# EAGLE board PCB_ROHM_BaAnh (EAGLE 9.6.2), part 1 of 2
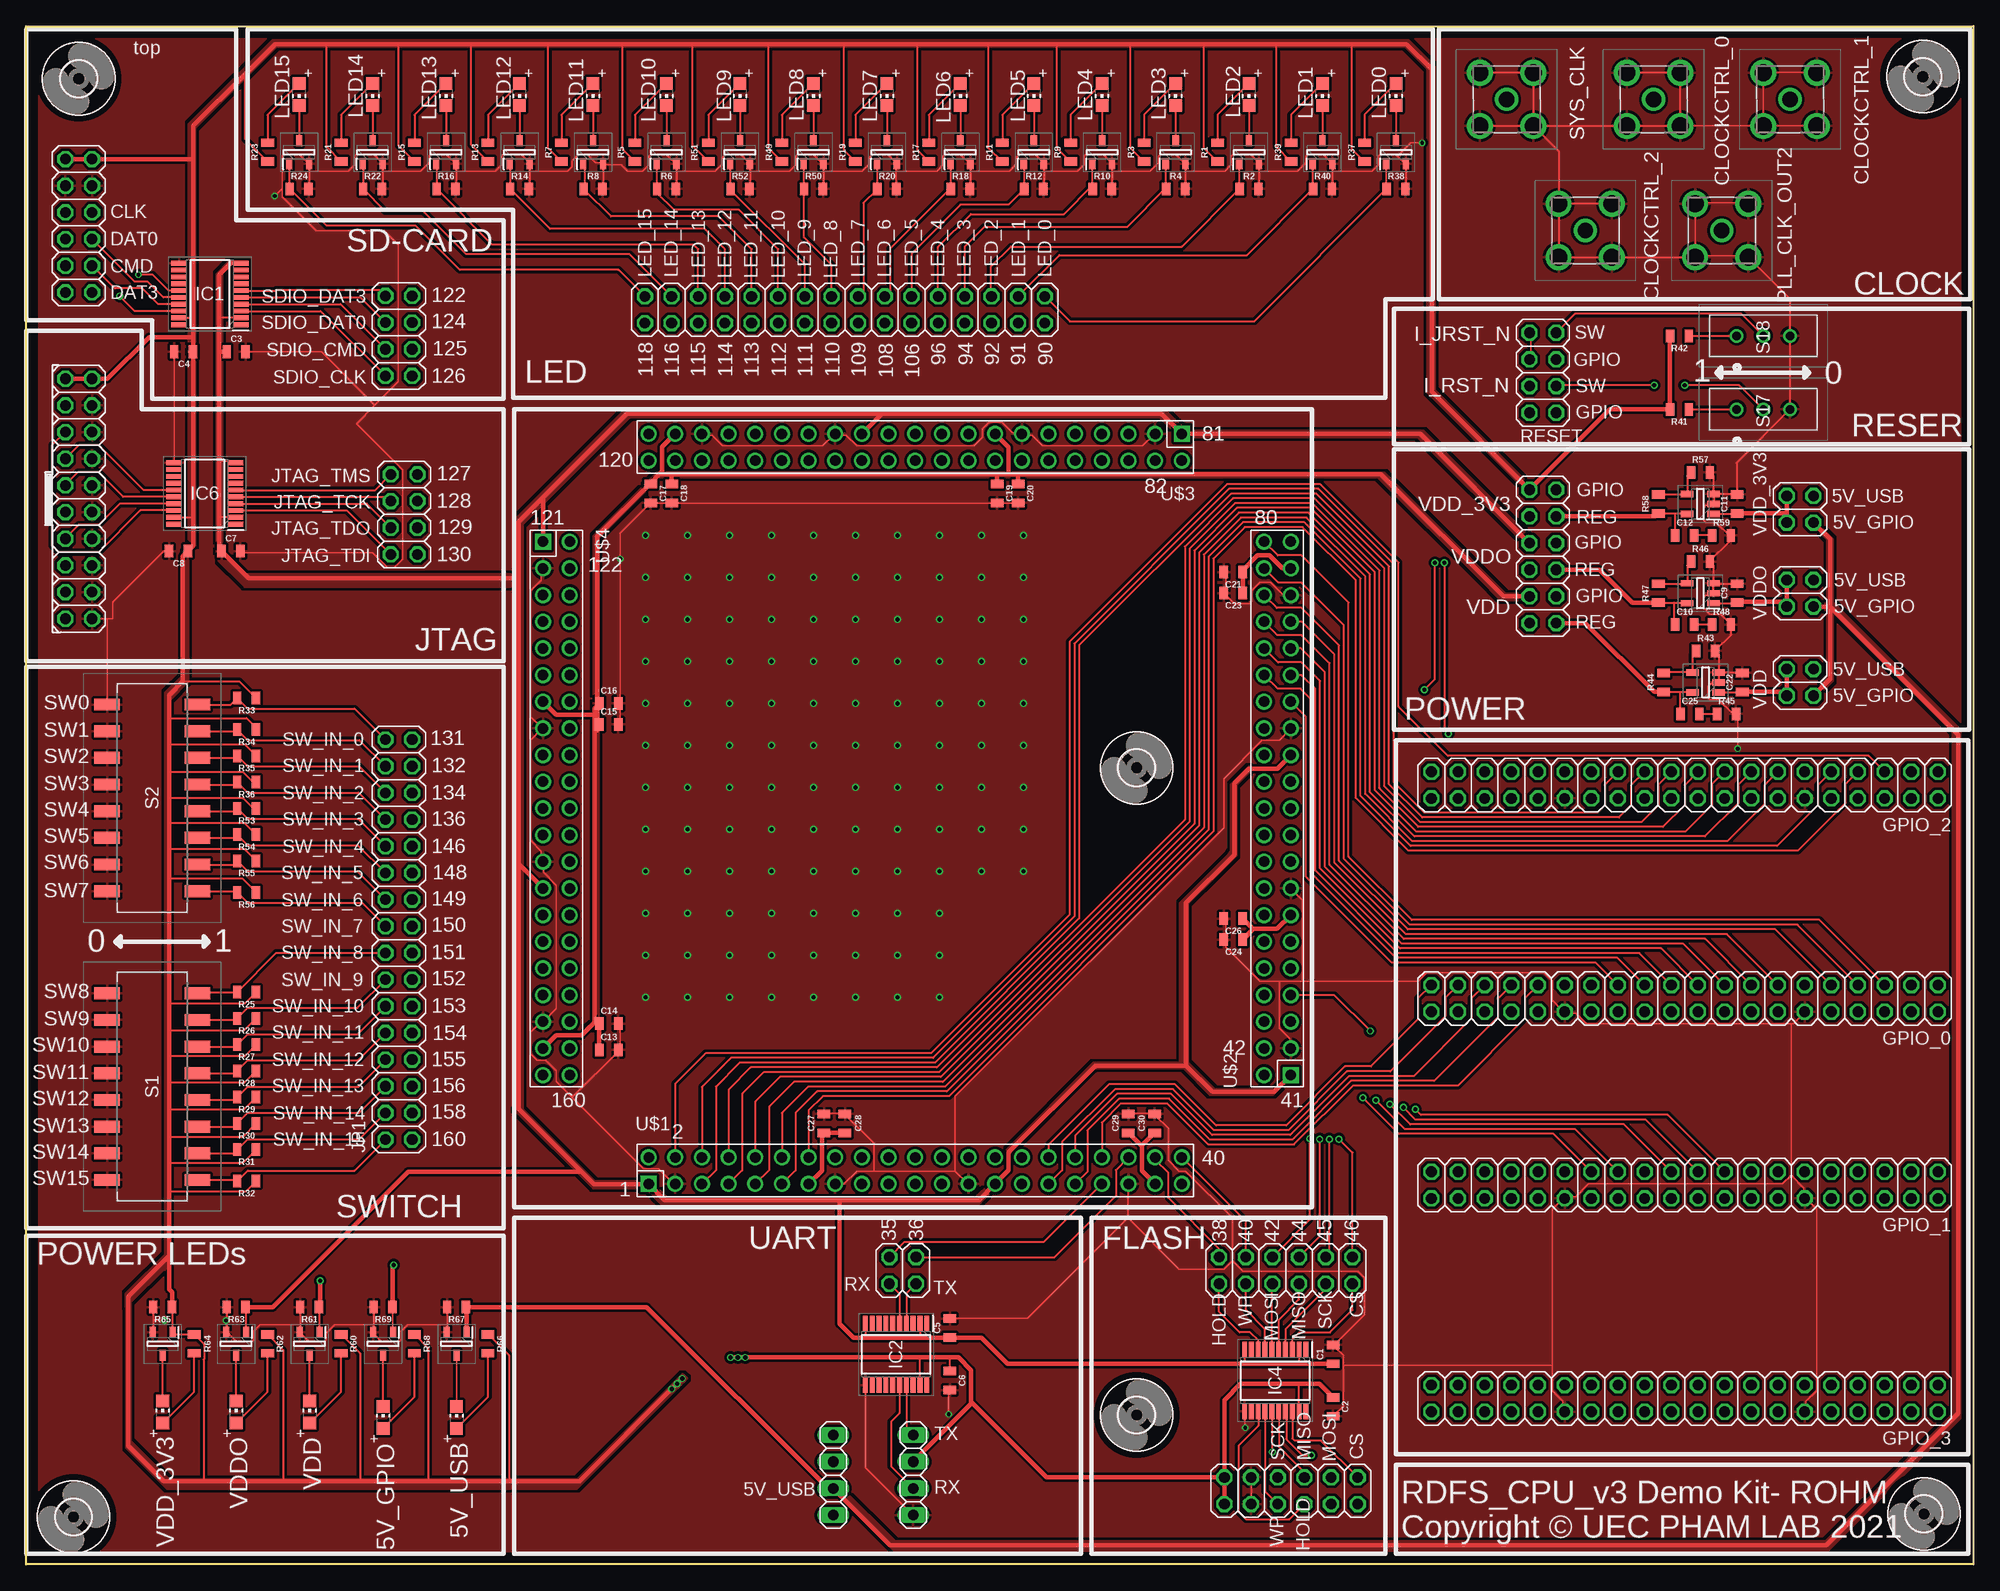
[diagram p5: board, top side]
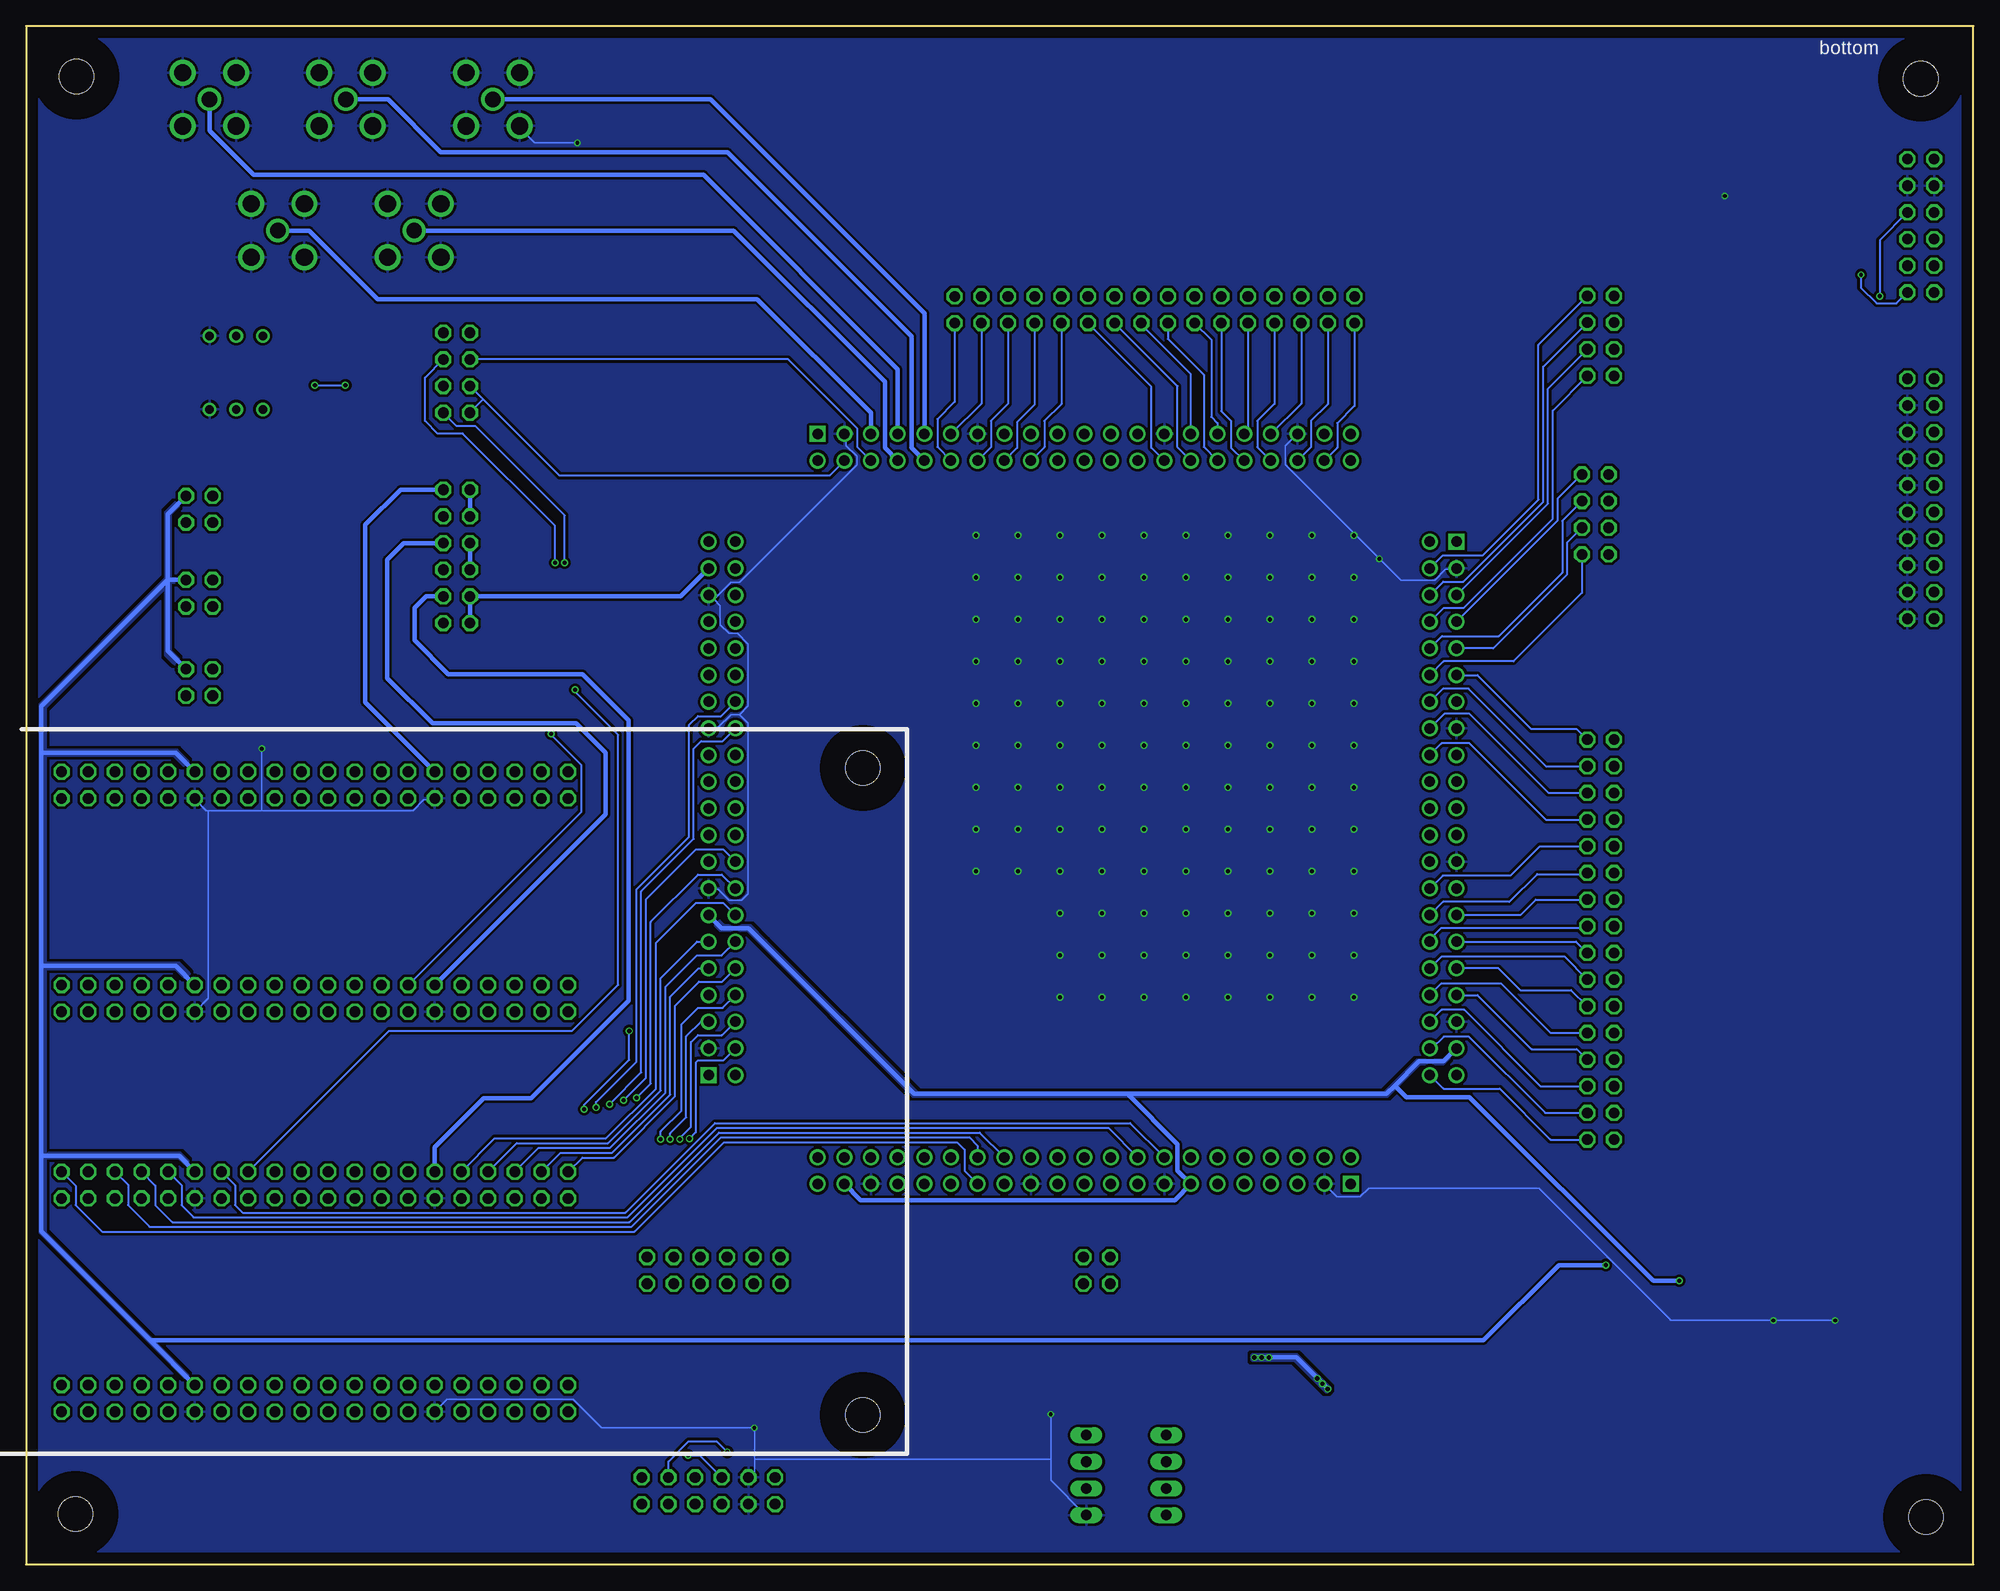
[diagram p6: board, bottom side, seen from below]

Size 185.5 x 146.5 mm. Coordinates in mm from the lower left corner, seen from the top.
Outline: 0,146.5 185.5,146.5 185.5,0 0,0 0,146.5
Copper layers (1*16): Top 0.035mm / dielectric 1.5mm / Bottom 0.035mm
Design rules "default *": minimum track width 6mil, minimum drill 0.35mm, track to track 10mil, track to pad 10mil, pad to pad 6mil, via to via 10mil, smd to smd 10mil, copper to edge 40mil, drill to drill 6mil, minimum pad ring 0.13mm, minimum via ring 0.13mm, stop-mask expansion 4mil, vias tented up to drill 0mil, thermal gap 10mil

## Footprints (pad centres in the part's own frame; a part is rotated, then mirrored left to right if it is on the bottom)
0805 = smd 0.8 x 1.2: 1 -0.9,0; 2 0.9,0
29856004 = drill 1.64 pad 2.46: 1 0,0; 2 5.08,0; 3 5.08,5.08; 4 0,5.08 | drill 1.47 pad 2.205: 5 2.54,2.54
2X06 = drill 1.016 octagon: 1 -6.35,-1.27; 2 -6.35,1.27; 3 -3.81,-1.27; 4 -3.81,1.27; 5 -1.27,-1.27; 6 -1.27,1.27; 7 1.27,-1.27; 8 1.27,1.27; 9 3.81,-1.27; 10 3.81,1.27; 11 6.35,-1.27; 12 6.35,1.27
2X20 = drill 1.016 octagon: 1 -24.13,-1.27; 2 -24.13,1.27; 3 -21.59,-1.27; 4 -21.59,1.27; 5 -19.05,-1.27; 6 -19.05,1.27; 7 -16.51,-1.27; 8 -16.51,1.27; 9 -13.97,-1.27; 10 -13.97,1.27; 11 -11.43,-1.27; 12 -11.43,1.27; 13 -8.89,-1.27; 14 -8.89,1.27; 15 -6.35,-1.27; 16 -6.35,1.27; 17 -3.81,-1.27; 18 -3.81,1.27; 19 -1.27,-1.27; 20 -1.27,1.27; 21 1.27,-1.27; 22 1.27,1.27; 23 3.81,-1.27; 24 3.81,1.27; 25 6.35,-1.27; 26 6.35,1.27; 27 8.89,-1.27; 28 8.89,1.27; 29 11.43,-1.27; 30 11.43,1.27; 31 13.97,-1.27; 32 13.97,1.27; 33 16.51,-1.27; 34 16.51,1.27; 35 19.05,-1.27; 36 19.05,1.27; 37 21.59,-1.27; 38 21.59,1.27; 39 24.13,-1.27; 40 24.13,1.27
3,3 = hole 3.3: 0,0
SOP65P640X120-20N = smd 1.475 x 0.45: 1 -2.938,2.925; 2 -2.938,2.275; 3 -2.938,1.625; 4 -2.938,0.975; 5 -2.938,0.325; 6 -2.938,-0.325; 7 -2.938,-0.975; 8 -2.938,-1.625; 9 -2.938,-2.275; 10 -2.938,-2.925; 11 2.938,-2.925; 12 2.938,-2.275; 13 2.938,-1.625; 14 2.938,-0.975; 15 2.938,-0.325; 16 2.938,0.325; 17 2.938,0.975; 18 2.938,1.625; 19 2.938,2.275; 20 2.938,2.925
SOT95P280X145-5N = smd 1.2 x 0.6: 1 -1.25,0.95; 2 -1.25,0; 3 -1.25,-0.95; 4 1.25,-0.95; 5 1.25,0.95
2X16 = drill 1.016 octagon: 1 -19.05,-1.27; 2 -19.05,1.27; 3 -16.51,-1.27; 4 -16.51,1.27; 5 -13.97,-1.27; 6 -13.97,1.27; 7 -11.43,-1.27; 8 -11.43,1.27; 9 -8.89,-1.27; 10 -8.89,1.27; 11 -6.35,-1.27; 12 -6.35,1.27; 13 -3.81,-1.27; 14 -3.81,1.27; 15 -1.27,-1.27; 16 -1.27,1.27; 17 1.27,-1.27; 18 1.27,1.27; 19 3.81,-1.27; 20 3.81,1.27; 21 6.35,-1.27; 22 6.35,1.27; 23 8.89,-1.27; 24 8.89,1.27; 25 11.43,-1.27; 26 11.43,1.27; 27 13.97,-1.27; 28 13.97,1.27; 29 16.51,-1.27; 30 16.51,1.27; 31 19.05,-1.27; 32 19.05,1.27
2X04 = drill 1.016 octagon: 1 -3.81,-1.27; 2 -3.81,1.27; 3 -1.27,-1.27; 4 -1.27,1.27; 5 1.27,-1.27; 6 1.27,1.27; 7 3.81,-1.27; 8 3.81,1.27
2X10 = drill 1.016 octagon: 1 -11.43,-1.27; 2 -11.43,1.27; 3 -8.89,-1.27; 4 -8.89,1.27; 5 -6.35,-1.27; 6 -6.35,1.27; 7 -3.81,-1.27; 8 -3.81,1.27; 9 -1.27,-1.27; 10 -1.27,1.27; 11 1.27,-1.27; 12 1.27,1.27; 13 3.81,-1.27; 14 3.81,1.27; 15 6.35,-1.27; 16 6.35,1.27; 17 8.89,-1.27; 18 8.89,1.27; 19 11.43,-1.27; 20 11.43,1.27
CHIP-LED0805 = smd 1.2 x 1.2: A 0,-1.05; C 0,1.05
SOT95P230X110-3N = smd 1.05 x 0.6: 1 -1.1,0.95; 2 -1.1,-0.95; 3 1.1,0
2198LPST = smd 1.13 x 2.44: 1 -8.89,-4.3; 2 -6.35,-4.3; 3 -3.81,-4.3; 4 -1.27,-4.3; 5 1.27,-4.3; 6 3.81,-4.3; 7 6.35,-4.3; 8 8.89,-4.3; 9 8.89,4.3; 10 6.35,4.3; 11 3.81,4.3; 12 1.27,4.3; 13 -1.27,4.3; 14 -3.81,4.3; 15 -6.35,4.3; 16 -8.89,4.3
SS12SDP2 = drill 0.8 pad 1.3: 1 0,2.54; 2 0,0; 3 0,-2.54
2X41_HEADER = drill 1 pad 1.524 square: 1 -25.4,-1.27 | drill 1 pad 1.524: 2 -25.4,1.27; 3 -22.86,-1.27; 4 -22.86,1.27; 5 -20.32,-1.27; 6 -20.32,1.27; 7 -17.78,-1.27; 8 -17.78,1.27; 9 -15.24,-1.27; 10 -15.24,1.27; 11 -12.7,-1.27; 12 -12.7,1.27; 13 -10.16,-1.27; 14 -10.16,1.27; 15 -7.62,-1.27; 16 -7.62,1.27; 17 -5.08,-1.27; 18 -5.08,1.27; 19 -2.54,-1.27; 20 -2.54,1.27; 21 0,-1.27; 22 0,1.27; 23 2.54,-1.27; 24 2.54,1.27; 25 5.08,-1.27; 26 5.08,1.27; 27 7.62,-1.27; 28 7.62,1.27; 29 10.16,-1.27; 30 10.16,1.27; 31 12.7,-1.27; 32 12.7,1.27; 33 15.24,-1.27; 34 15.24,1.27; 35 17.78,-1.27; 36 17.78,1.27; 37 20.32,-1.27; 38 20.32,1.27; 39 22.86,-1.27; 40 22.86,1.27; 41 25.4,-1.27; 42 25.4,1.27
2X02 = drill 1.016 octagon: 1 -1.27,-1.27; 2 -1.27,1.27; 3 1.27,-1.27; 4 1.27,1.27
1X04 = drill 1.016 long: 1 -3.81,0; 2 -1.27,0; 3 1.27,0; 4 3.81,0

## Placement (x,y rotation side)
C1  0.1uF  [0805]  124.5,20 90 top
C2  0.1uF  [0805]  124.5,15 270 top
C3  0.1uF  [0805]  20,115.5 0 top
C4  0.1uF  [0805]  15,115.5 180 top
C5  0.1uF  [0805]  88,22.5 90 top
C6  0.1uF  [0805]  88,17.5 270 top
C7  0.1uF  [0805]  19.5,96.5 0 top
C8  0.1uF  [0805]  14.5,96.5 180 top
C9  1.0uF  [0805]  163,92.5 90 top
C10  4.7uF  [0805]  158,89.5 0 top
C11  1.0uF  [0805]  163,101 90 top
C12  4.7uF  [0805]  158,98 0 top
C13  1.0uF  [0805]  55.5,49 0 top
C14  10pF  [0805]  55.5,51.5 0 top
C15  1.0uF  [0805]  55.5,80 0 top
C16  10pF  [0805]  55.5,82 0 top
C17  1.0uF  [0805]  59.5,102 270 top
C18  10pF  [0805]  61.5,102 270 top
C19  1.0uF  [0805]  92.5,102 270 top
C20  10pF  [0805]  94.5,102 270 top
C21  1.0uF  [0805]  115,94.5 180 top
C22  1.0uF  [0805]  163.5,84 90 top
C23  10pF  [0805]  115,92.5 180 top
C24  1.0uF  [0805]  115,59.5 180 top
C25  4.7uF  [0805]  158.5,81 0 top
C26  10pF  [0805]  115,61.5 180 top
C27  1.0uF  [0805]  76,42 90 top
C28  10pF  [0805]  78,42 90 top
C29  1.0uF  [0805]  105,42 90 top
C30  10pF  [0805]  107.5,42 90 top
CLOCKCTRL_0  2985-6004  [29856004]  152.5,137 0 top
CLOCKCTRL_1  2985-6004  [29856004]  165.5,137 0 top
CLOCKCTRL_2  2985-6004  [29856004]  146,124.5 0 top
FLASH_CONNECTOR  PINHD-2X6  [2X06]  120.5,7 0 top
GPIO_0  [2X20]  158,53.9 180 top
GPIO_1  [2X20]  158,36.12 180 top
GPIO_2  [2X20]  158,74.22 180 top
GPIO_3  [2X20]  158,15.8 180 top
H1  MOUNT-HOLE3.3  [3,3]  105.79,75.86 0 top
H2  MOUNT-HOLE3.3  [3,3]  105.79,14.22 0 top
H3  MOUNT-HOLE3.3  [3,3]  5,141.5 0 top
H4  MOUNT-HOLE3.3  [3,3]  4.5,4.5 0 top
H5  MOUNT-HOLE3.3  [3,3]  180.7,141.7 0 top
H6  MOUNT-HOLE3.3  [3,3]  180.8,4.8 0 top
IC1  TXB0108PWR  [SOP65P640X120-20N]  17.5,121 180 top
IC2  TXB0108PWR  [SOP65P640X120-20N]  82.87,20 270 top
IC3  TPS76201DBVR  [SOT95P280X145-5N]  160,84 180 top
IC4  TXB0108PWR  [SOP65P640X120-20N]  119,17.5 270 top
IC5  TPS76201DBVR  [SOT95P280X145-5N]  159.5,92.5 180 top
IC6  TXB0108PWR  [SOP65P640X120-20N]  17,102 180 top
IC7  TPS76201DBVR  [SOT95P280X145-5N]  159.5,101 180 top
JP1  [2X16]  35.5,59.5 90 top
JTAG  [2X04]  36,100 90 top
JTAG_CONNECTOR  [2X10]  5,101.5 270 top
LED  [2X16]  78,119.5 0 top
LED1  [CHIP-LED0805]  116.5,140 180 top
LED2  [CHIP-LED0805]  109.5,140 180 top
LED3  [CHIP-LED0805]  61,140 180 top
LED4  [CHIP-LED0805]  54,140 180 top
LED5  [CHIP-LED0805]  102.5,140 180 top
LED6  [CHIP-LED0805]  96,140 180 top
LED7  [CHIP-LED0805]  47,140 180 top
LED8  [CHIP-LED0805]  40,140 180 top
LED9  [CHIP-LED0805]  130.5,140 180 top
LED10  [CHIP-LED0805]  123.5,140 180 top
LED11  [CHIP-LED0805]  75,140 180 top
LED12  [CHIP-LED0805]  68,140 180 top
LED13  [CHIP-LED0805]  27,14.5 0 top
LED14  [CHIP-LED0805]  89,140 180 top
LED15  [CHIP-LED0805]  82,140 180 top
LED16  [CHIP-LED0805]  33,140 180 top
LED17  [CHIP-LED0805]  26,140 180 top
LED18  [CHIP-LED0805]  20,14.5 0 top
LED19  [CHIP-LED0805]  13,14.5 0 top
LED20  [CHIP-LED0805]  41,14 0 top
LED21  [CHIP-LED0805]  34,14 0 top
PLL_CLK_OUT2  2985-6004  [29856004]  159,124.5 0 top
POWER  [2X06]  144.5,96 90 top
Q1  BSH103,235  [SOT95P230X110-3N]  116.5,134.5 90 top
Q2  BSH103,235  [SOT95P230X110-3N]  109.5,134.5 90 top
Q3  BSH103,235  [SOT95P230X110-3N]  61,134.5 90 top
Q4  BSH103,235  [SOT95P230X110-3N]  54,134.5 90 top
Q5  BSH103,235  [SOT95P230X110-3N]  102.5,134.5 90 top
Q6  BSH103,235  [SOT95P230X110-3N]  96,134.5 90 top
Q7  BSH103,235  [SOT95P230X110-3N]  47,134.5 90 top
Q8  BSH103,235  [SOT95P230X110-3N]  40,134.5 90 top
Q9  BSH103,235  [SOT95P230X110-3N]  130.5,134.5 90 top
Q10  BSH103,235  [SOT95P230X110-3N]  123.5,134.5 90 top
Q11  BSH103,235  [SOT95P230X110-3N]  75,134.5 90 top
Q12  BSH103,235  [SOT95P230X110-3N]  68,134.5 90 top
Q13  BSH103,235  [SOT95P230X110-3N]  89,134.5 90 top
Q14  BSH103,235  [SOT95P230X110-3N]  82,134.5 90 top
Q15  BSH103,235  [SOT95P230X110-3N]  33,134.5 90 top
Q16  BSH103,235  [SOT95P230X110-3N]  26,134.5 90 top
Q17  BSH103,235  [SOT95P230X110-3N]  27,21 270 top
Q18  BSH103,235  [SOT95P230X110-3N]  20,21 270 top
Q19  BSH103,235  [SOT95P230X110-3N]  13,21 270 top
Q20  BSH103,235  [SOT95P230X110-3N]  41,21 270 top
Q21  BSH103,235  [SOT95P230X110-3N]  34,21 270 top
QSPI  [2X06]  120,28 180 top
R1  330  [0805]  113.5,134.5 270 top
R2  10k  [0805]  116.5,131 0 top
R3  330  [0805]  106.5,134.5 270 top
R4  10k  [0805]  109.5,131 0 top
R5  330  [0805]  58,134.5 270 top
R6  10k  [0805]  61,131 0 top
R7  330  [0805]  51,134.5 270 top
R8  10k  [0805]  54,131 0 top
R9  330  [0805]  99.5,134.5 270 top
R10  10k  [0805]  102.5,131 0 top
R11  330  [0805]  93,134.5 270 top
R12  10k  [0805]  96,131 0 top
R13  330  [0805]  44,134.5 270 top
R14  10k  [0805]  47,131 0 top
R15  330  [0805]  37,134.5 270 top
R16  10k  [0805]  40,131 0 top
R17  330  [0805]  86,134.5 270 top
R18  10k  [0805]  89,131 0 top
R19  330  [0805]  79,134.5 270 top
R20  10k  [0805]  82,131 0 top
R21  330  [0805]  30,134.5 270 top
R22  10k  [0805]  33,131 0 top
R23  330  [0805]  23,134.5 270 top
R24  10k  [0805]  26,131 0 top
R25  10k  [0805]  21,54.5 180 top
R26  10k  [0805]  21,52 180 top
R27  10k  [0805]  21,49.5 180 top
R28  10k  [0805]  21,47 180 top
R29  10k  [0805]  21,44.5 180 top
R30  10k  [0805]  21,42 180 top
R31  10k  [0805]  21,39.5 180 top
R32  10k  [0805]  21,36.5 180 top
R33  10k  [0805]  21,82.5 180 top
R34  10k  [0805]  21,79.5 180 top
R35  10k  [0805]  21,77 180 top
R36  10k  [0805]  21,74.5 180 top
R37  330  [0805]  127.5,134.5 270 top
R38  10k  [0805]  130.5,131 0 top
R39  330  [0805]  120.5,134.5 270 top
R40  10k  [0805]  123.5,131 0 top
R41  10k  [0805]  157.5,110 180 top
R42  10k  [0805]  157.5,117 180 top
R43  66.5k  [0805]  160,87 0 top
R44  113k  [0805]  156,84 90 top
R45  1  [0805]  162,81 0 top
R46  66.5k  [0805]  159.5,95.5 0 top
R47  113k  [0805]  155.5,92.5 90 top
R48  1  [0805]  161.5,89.5 0 top
R49  330  [0805]  72,134.5 270 top
R50  10k  [0805]  75,131 0 top
R51  330  [0805]  65,134.5 270 top
R52  10k  [0805]  68,131 0 top
R53  10k  [0805]  21,72 180 top
R54  10k  [0805]  21,69.5 180 top
R55  10k  [0805]  21,67 180 top
R56  10k  [0805]  21,64 180 top
R57  66.5k  [0805]  159.5,104 0 top
R58  243k  [0805]  155.5,101 90 top
R59  1  [0805]  161.5,98 0 top
R60  330  [0805]  30,21 90 top
R61  10k  [0805]  27,24.5 180 top
R62  330  [0805]  23,21 90 top
R63  10k  [0805]  20,24.5 180 top
R64  330  [0805]  16,21 90 top
R65  10k  [0805]  13,24.5 180 top
R66  330  [0805]  44,21 90 top
R67  10k  [0805]  41,24.5 180 top
R68  330  [0805]  37,21 90 top
R69  10k  [0805]  34,24.5 180 top
RESET  [2X04]  144.5,113.5 270 top
S1  219-8LPST  [2198LPST]  12,45.5 90 top
S2  219-8LPST  [2198LPST]  12,73 90 top
S17  SS12SDP2  [SS12SDP2]  165.5,110 90 top
S18  SS12SDP2  [SS12SDP2]  165.5,117 90 top
SDCARD  [2X04]  35.5,117 90 top
SDCARD_CONNECTOR  PINHD-2X6  [2X06]  5,127.5 270 top
SYS_CLK  2985-6004  [29856004]  138.5,137 0 top
U$1  [2X41_HEADER]  84.7,37.5 0 top
U$2  [2X41_HEADER]  119.2,72 90 top
U$3  [2X41_HEADER]  84.7,106.4 180 top
U$4  [2X41_HEADER]  50.5,72 270 top
UART  PINHD-2X2  [2X02]  83.5,28 180 top
USB-UART_1  PINHD-1X4  [1X04]  84.5,8.5 90 top
USB-UART_2  PINHD-1X4  [1X04]  76.88,8.5 90 top
VDD  [2X02]  169,84 90 top
VDD_3V3  [2X02]  169,100.5 90 top
VDDO  [2X02]  169,92.5 90 top